# EAGLE design main (EAGLE 7.1.0)
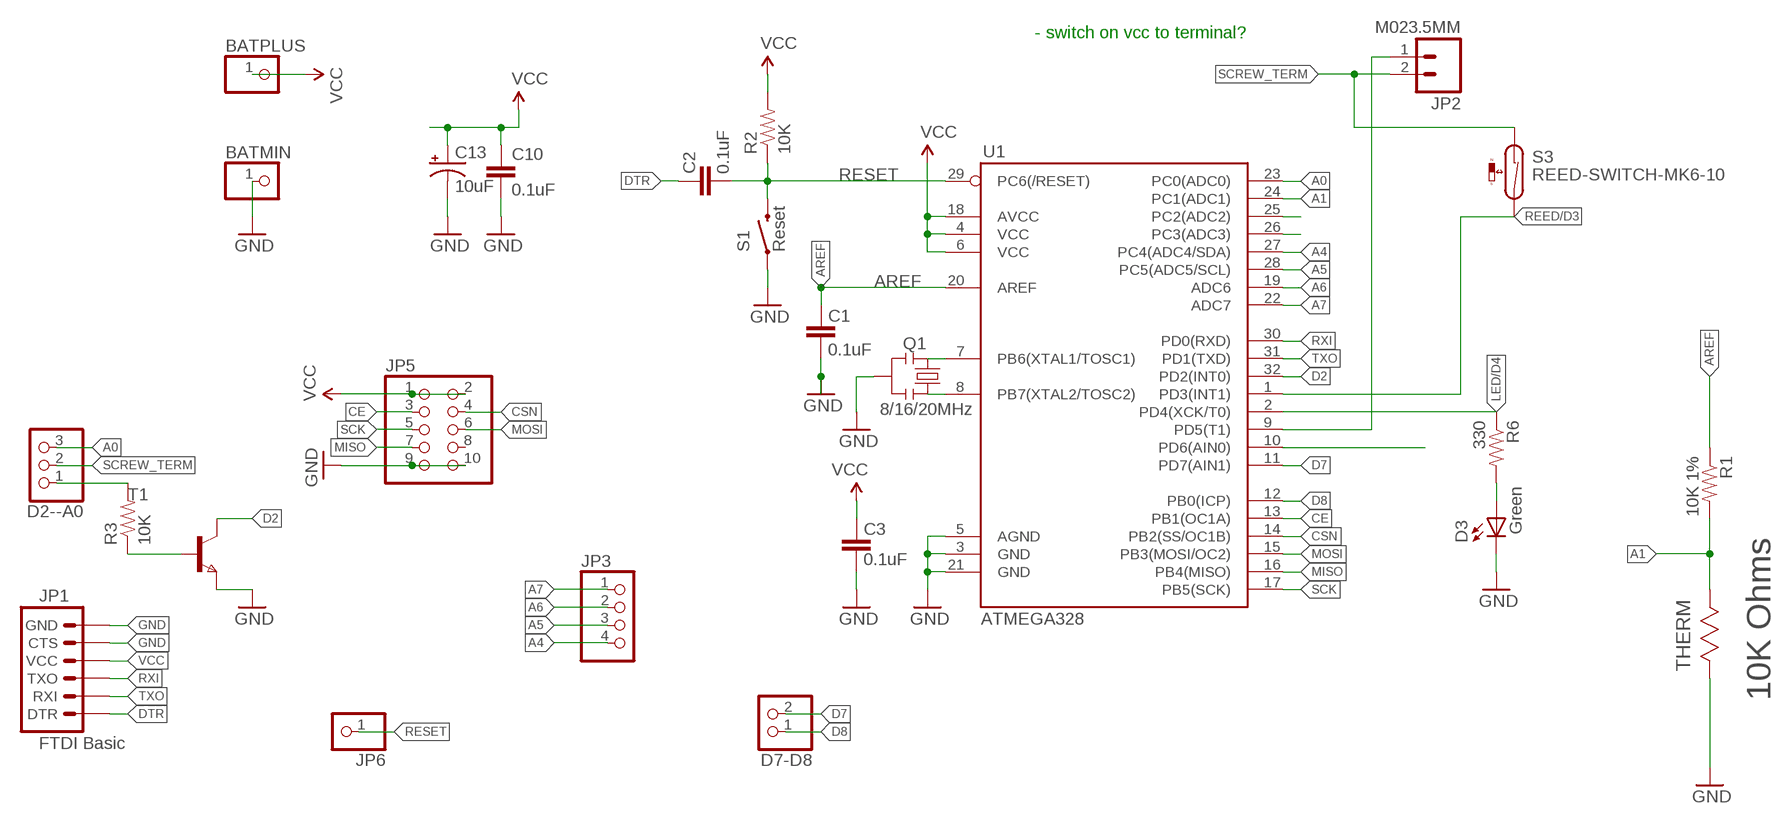
[diagram p0: schematic, sheet 1]

## Parts
BATMIN  PINHD-1X1  [1X01]
BATPLUS  PINHD-1X1  [1X01]
C1  0.1uF  CAP0603-CAP  [0603-CAP]
C2  0.1uF  CAP0603-CAP  [0603-CAP]
C3  0.1uF  CAP0603-CAP  [0603-CAP]
C10  0.1uF  CAP0603-CAP  [0603-CAP]
C13  10uF  CAP_POL1206  [EIA3216]
D2--A0  PINHD-1X3  [1X03]
D3  Green  LED  [0603-LED-ALT1]
D7-D8  PINHD-1X2  [1X02]
JP1  FTDI Basic  ARDUINO_SERIAL_PROGRAMPTH  [1X06]
JP2  M023.5MM  [SCREWTERMINAL-3.5MM-2]
JP3  PINHD-1X4  [1X04]
JP5  PINHD-2X5  [2X05]
JP6  PINHD-1X1  [1X01]
Q1  8/16/20MHz  RESONATOR1:1  [RESONATOR-SMD-1:1]
R1  10K 1%  RESISTOR0603-RES  [0603-RES]
R2  10K  RESISTOR0603-RES  [0603-RES]
R3  10K  RESISTOR0603-RES  [0603-RES]
R6  330  RESISTOR0603-RES  [0603-RES]
S1  Reset  SWITCH-MOMENTARY-2SMD-ALT01  [TACTILE-SWITCH-SMD-ALT01]
S3  REED-SWITCH-MK6-10  [MK6-10]
T1  NPNSOT323  [SOT323]
THERM  10K Ohms  NTCS0603E3103HMT  [RESC1608X95N]
U1  ATMEGA328  ATMEGA168  [TQFP32-08]

## Nets
A0: D2--A0.3 U1.23(PC0(ADC0))
A1: R1.2 THERM.1 U1.24(PC1(ADC1))
A2: U1.25(PC2(ADC2))
A3: U1.26(PC3(ADC3))
A4: JP3.4 U1.27(PC4(ADC4/SDA))
A5: JP3.3 U1.28(PC5(ADC5/SCL))
A6: JP3.2 U1.19(ADC6)
A7: JP3.1 U1.22(ADC7)
AREF: C1.2 R1.1 U1.20(AREF)
CE: JP5.3 U1.13(PB1(OC1A))
CSN: JP5.4 U1.14(PB2(SS/OC1B))
D2: T1.1(C) U1.32(PD2(INT0))
D5: JP2.1 U1.9(PD5(T1))
D7: D7-D8.2 U1.11(PD7(AIN1))
D8: D7-D8.1 U1.12(PB0(ICP))
DTR: C2.2 JP1.1(DTR)
GND [vcc]: BATMIN.1 C1.1 C3.1 C10.2 C13.C(-) D3.C JP1.5(CTS) JP1.6(GND) JP5.9 JP5.10 Q1.2 S1.1 S1.2 T1.3(E) THERM.2 U1.3(GND) U1.5(AGND) U1.21(GND)
LED/D4: R6.1 U1.2(PD4(XCK/T0))
MISO: JP5.7 U1.16(PB4(MISO))
MOSI: JP5.6 U1.15(PB3(MOSI/OC2))
N$1: Q1.3 U1.8(PB7(XTAL2/TOSC2))
N$2: Q1.1 U1.7(PB6(XTAL1/TOSC1))
N$3: D2--A0.1 R3.2
N$4: U1.10(PD6(AIN0))
N$6: R3.1 T1.2(B)
N$7: D3.A R6.2
REED/D3: S3.2 U1.1(PD3(INT1))
RESET: C2.1 JP6.1 R2.1 S1.3 S1.4 U1.29(PC6(/RESET))
RXI: JP1.3(TXO) U1.30(PD0(RXD))
SCK: JP5.5 U1.17(PB5(SCK))
SCREW_TERM: D2--A0.2 JP2.2 S3.1
TXO: JP1.2(RXI) U1.31(PD1(TXD))
VCC: BATPLUS.1 C3.2 C10.1 C13.A(+) JP1.4(VCC) JP5.1 JP5.2 R2.2 U1.4(VCC) U1.6(VCC) U1.18(AVCC)
Unconnected: JP5.8

## Notes on the sheet
- - switch on vcc to terminal?

## Library data of the parts
BATMIN BATPLUS JP6 = pinhead:PINHD-1X1: PIN HEADER
C1-C3 C10 = SparkFun:CAP: Capacitor Standard 0603 ceramic capacitor, and 0.1" leaded capacitor.
C13 = SparkFun:CAP_POL: Capacitor Polarized These are standard SMD and PTH capacitors. Normally 10uF, 47uF, and 100uF in electrolytic and tantalum varieties. Always verify the external diameter of the through hole cap, it varies with capacity, voltage, and manufacturer. The EIA devices should be standard.
D2--A0 = pinhead:PINHD-1X3: PIN HEADER
D3 = Testing:LED: LEDs Standard schematic elements and footprints for 5mm, 3mm, 1206, and 0603 sized LEDs. 5mm - Spark Fun Electronics SKU : COM-00529 (and others)
D7-D8 = pinhead:PINHD-1X2: PIN HEADER
JP1 = SparkFun:ARDUINO_SERIAL_PROGRAM
JP2 = SparkFun-Connectors:M02: Standard 2-pin 0.1" header. Use with - straight break away headers ( PRT-00116) - right angle break away headers (PRT-00553) - swiss pins (PRT-00743) - machine pins (PRT-00117) - female headers (PRT-00115) Molex polarized connector foot print use with: PRT-08233 with associated crimp pins and housings. 2.54_SCREWTERM for use with PRT-10571. 3.5mm Screw Terminal footprints for PRT-08084 5mm Screw Terminal footprints for use with PRT-08432
JP3 = pinhead:PINHD-1X4: PIN HEADER
JP5 = pinhead:PINHD-2X5: PIN HEADER
Q1 = Testing:RESONATOR: Resonator Small SMD resonator. This is the itty bitty 10/20MHz resonators with built in caps. CSTCE10M0G55 and CSTCE20M0V53. Footprint for SMD has been used in SFE production for years, and does work okay. 1:1 is an attempt to get larger fillets on the sides so it will be easier to inspect these solders in our AOI machine. The pads have been minimized to match the actual metal under the resonator. To see this relation, it includes an image import of the bottom side of the component. Imported to scale on layer 200.
R1-R3 R6 = SparkFun:RESISTOR: Resistor Basic schematic elements and footprints for 0603, 1206, and PTH resistors.
S1 = Testing:SWITCH-MOMENTARY-2: Various NO switches- pushbuttons, reed, etc
S3 = switch-reed:REED-SWITCH-: Reed Sensor; OC_FARNELL: unknown
T1 = zetex:NPNSOT323: NPN TRANSISTOR; MPN: DSS4160U-7; OC_FARNELL: 1710696; OC_NEWARK: 25R4558
THERM = Vishay_By_element14_Batch_1:NTCS0603E3103HMT: RESISTOR, 0603; MPN: NTCS0603E3103HMT; OC_FARNELL: 1874161; OC_NEWARK: 63H2050; SUPPLIER: Vishay; TOLERANCE: ± 3%; WATTAGE: 125 mW
U1 = SparkFun:ATMEGA168

## Net classes
1 vcc: width 0.254 mm

## Board
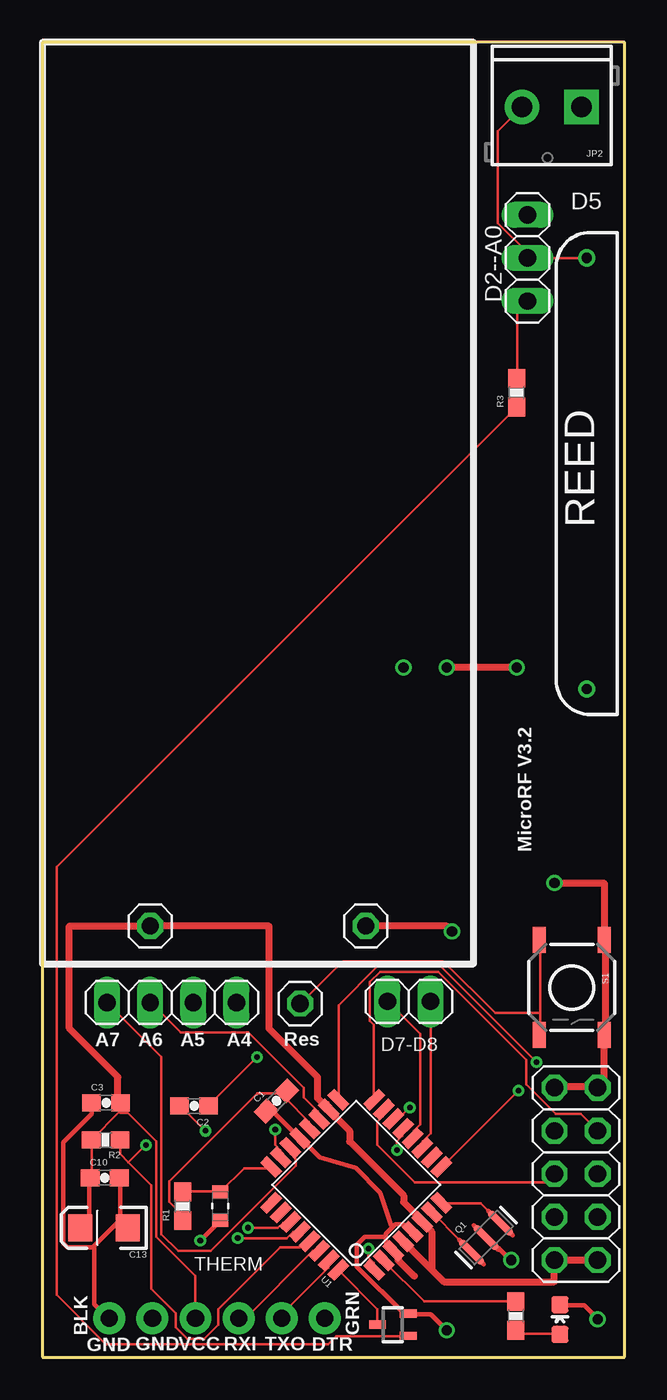
[diagram p1: board, top side]
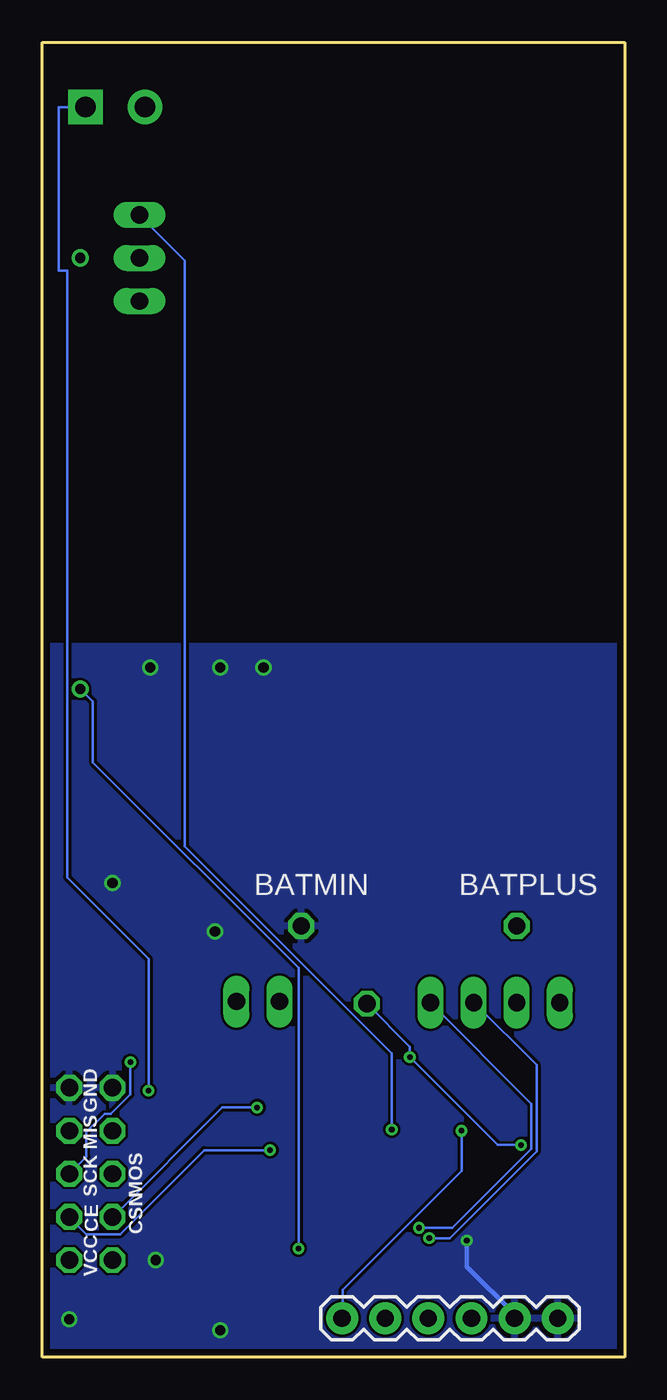
[diagram p2: board, bottom side, seen from below]

Size 34.29 x 77.47 mm. Coordinates in mm from the lower left corner, seen from the top.
Outline: 0,77.47 0,0 34.29,0 34.29,77.47 0,77.47
Copper layers (1*16): Top 0.0356mm / dielectric 1.5011mm / Bottom 0.0356mm
Design rules "OSHPark": minimum track width 6mil, minimum drill 13mil, track to track 6mil, track to pad 6mil, pad to pad 6mil, via to via 6mil, smd to smd 6mil, copper to edge 15mil, drill to drill 6mil, minimum pad ring 7mil, minimum via ring 7mil, stop-mask expansion 3mil, vias tented up to drill 0mil, thermal gap 10mil

### Footprints (pad centres in the part's own frame; a part is rotated, then mirrored left to right if it is on the bottom)
1X01 = drill 1.016 octagon: 1 0,0
0603-CAP = smd 1.1 x 1: 1 -0.85,0; 2 0.85,0
EIA3216 = smd 1.4 x 1.6: A 1.4,0; C -1.4,0
1X03 = drill 1.016 long: 1 -2.54,0; 2 0,0; 3 2.54,0
0603-LED-ALT1 = smd 1 x 1: A 0,-0.877; C 0,0.877
1X02 = drill 1.016 long: 1 -1.27,0; 2 1.27,0
1X06 = drill 1.016 pad 1.88: 1 0,0; 2 2.54,0; 3 5.08,0; 4 7.62,0; 5 10.16,0; 6 12.7,0
SCREWTERMINAL-3.5MM-2 = drill 1.2 pad 2.032 square: 1 0,0 | drill 1.2 pad 2.032: 2 3.5,0
1X04 = drill 1.016 long: 1 -3.81,0; 2 -1.27,0; 3 1.27,0; 4 3.81,0
2X05 = drill 1.016 octagon: 1 -5.08,-1.27; 2 -5.08,1.27; 3 -2.54,-1.27; 4 -2.54,1.27; 5 0,-1.27; 6 0,1.27; 7 2.54,-1.27; 8 2.54,1.27; 9 5.08,-1.27; 10 5.08,1.27
RESONATOR-SMD-1:1 = smd 0.45 x 1.905: 1 -1.2,0; 2 0,0; 3 1.2,0
0603-RES = smd 1.1 x 1: 1 -0.85,0; 2 0.85,0
TACTILE-SWITCH-SMD-ALT01 = smd 1.524 x 0.762: 1 -2.794,1.905; 2 2.794,1.905; 3 -2.794,-1.905; 4 2.794,-1.905
MK6-10 = drill 0.6 pad 1.016: 1 -12.7,0; 2 12.7,0
SOT323 = smd 0.5 x 1: 1 0,0.9; 2 -0.65,-0.9; 3 0.65,-0.9
RESC1608X95N = smd 0.762 x 0.94: 1 -0.838,0; 2 0.838,0
TQFP32-08 = smd 1.27 x 0.559: 1 -4.293,2.8; 2 -4.293,2; 3 -4.293,1.2; 4 -4.293,0.4; 5 -4.293,-0.4; 6 -4.293,-1.2; 7 -4.293,-2; 8 -4.293,-2.8; 17 4.293,-2.8; 18 4.293,-2; 19 4.293,-1.2; 20 4.293,-0.4; 21 4.293,0.4; 22 4.293,1.2; 23 4.293,2; 24 4.293,2.8 | smd 0.559 x 1.27: 9 -2.8,-4.293; 10 -2,-4.293; 11 -1.2,-4.293; 12 -0.4,-4.293; 13 0.4,-4.293; 14 1.2,-4.293; 15 2,-4.293; 16 2.8,-4.293; 25 2.8,4.293; 26 2,4.293; 27 1.2,4.293; 28 0.4,4.293; 29 -0.4,4.293; 30 -1.2,4.293; 31 -2,4.293; 32 -2.8,4.293

### Placement (x,y rotation side)
BATMIN  19.05,25.4 0 top
BATPLUS  6.35,25.4 0 top
C1  13.79,15.09 45 top
C2  8.93,14.8 180 top
C3  3.75,14.99 0 top
C10  3.67,10.57 0 top
C13  3.62,7.62 180 top
D2--A0  28.57,64.77 90 top
D3  30.48,2.21 0 top
D7-D8  21.59,20.95 0 top
JP1  16.64,2.29 0 bottom
JP2  31.75,73.66 180 top
JP3  7.62,20.89 0 top
JP5  31.43,10.79 90 top
JP6  15.18,20.83 0 top
Q1  26.13,7.05 45 top
R1  8.26,8.89 90 top
R2  3.72,12.8 180 top
R3  27.94,56.83 90 top
R6  27.88,2.43 270 top
S1  31.18,21.78 270 top
S3  32.07,52.07 270 top
T1  20.64,1.91 90 top
THERM  10.48,8.89 270 top
U1  18.49,10.15 135 top

### Tracks (layer width: path | path; a pad name or v marks a point on that pad's centre or on a via)
A0  (via drill 0.33)
  Top 0.152: v13.72,13.41 13.72,12.5 14.02,12.19 14.02,11.81 U1.23
  Bottom 0.152: v13.72,13.41 13.72,17.91 25.91,30.1 25.91,64.62 28.57,67.28 D2--A0.3
A1
  Top 0.152: R1.2 8.31,9.75 10.44,9.75 THERM.1 10.52,9.75 11.89,11.12 13.41,11.12 U1.24
A4  (via drill 0.33)
  Top 0.152: v12.12,7.62 13.87,7.62 14.17,7.92 14.55,7.92 U1.27
  Bottom 0.152: v12.12,7.62 10.13,7.62 5.49,12.27 5.49,14.94 JP3.4
A5  (via drill 0.33)
  Top 0.152: v11.51,7.01 14.4,7.01 14.78,7.39 U1.28
  Bottom 0.152: v11.51,7.01 10.29,7.01 5.18,12.12 5.18,17.22 8.84,20.88 JP3.3
A6
  Top 0.152: U1.19 16.23,14.1 16.23,14.48 15.39,15.32 15.39,15.85 12.12,19.13 8.15,19.13 6.4,20.88 JP3.2
A7
  Top 0.152: U1.22 14.63,12.27 14.63,11.96 14.94,11.66 14.94,11.28 9.91,6.25 8,6.25 7.01,7.24 7.01,17.68 JP3.1
AREF
  Top 0.152: U1.20 15.7,13.49 15.7,13.87 14.33,15.24 14.33,15.54 C1.2 14.25,15.54 12.65,15.54 7.47,10.36 7.47,9.14 8.23,8.38 8.23,8.08 R1.1
CE  (via drill 0.33)
  Top 0.152: v20.88,12.19 20.88,12.72 21.18,13.03 21.18,13.41 U1.13
  Bottom 0.152: v20.88,12.19 24.77,12.19 29.72,7.24 31.7,7.24 32.69,8.23 JP5.3
CSN  (via drill 0.33)
  Top 0.152: v21.64,14.71 21.03,14.1 20.73,14.1 U1.14
  Bottom 0.152: v21.64,14.71 23.7,14.71 30.1,8.31 JP5.4
D2
  Top 0.152: T1.1 19.74,2.82 17.45,5.11 U1.32
D5  (via drill 0.33)
  Top 0.152: v28.04,15.7 23.55,11.2 U1.9 | 31.77,73.61 JP2.1
  Bottom 0.152: v28.04,15.7 28.04,23.47 32.84,28.27 32.84,64.01 33.34,64.01 33.34,73.66 JP2.1
D7
  Top 0.152: D7-D8.2 22.86,13.18 22.4,12.72 22.4,12.34 U1.11
D8
  Top 0.152: U1.12 21.87,12.95 21.87,13.34 22.25,13.72 22.25,19.05 20.34,20.95 D7-D8.1
DTR  (via drill 0.33)
  Top 0.152: v9.6,13.34 8.15,14.78 C2.2
  Bottom 0.152: v9.6,13.34 9.6,10.97 16.61,3.96 16.61,2.29 JP1.1
GND  (via drill 0.33, 0.6)
  Top 0.254: C10.2 4.6,10.55 4.6,8.04 4.94,7.7 C13.C 4.5,8 2.97,6.48 | 20.21,7.09 20.21,7.25 20.61,7.66 | 20.21,7.09 20.21,6.76 20.7,6.28 U1.3 | 20.61,7.66 20.78,7.82 21.26,7.82 21.75,7.33 U1.5 | 20.61,7.66 20.53,7.74 19.9,9.69 18.45,11.14 16.33,11.78 15.2,12.91 U1.21 15.09,12.95 13.56,14.48 13.26,14.48 C1.1 | 2.97,6.48 1.45,6.48 1.22,6.71 1.22,12.65 2.9,14.33 2.9,14.94 C3.1 | D3.C 30.48,3.05 31.93,3.05 32.69,2.29 v32.7,2.22 | 32.69,15.93 JP5.9 32.77,16 | 2.97,6.48 3.05,6.4 3.05,3.12 3.89,2.29 JP1.6 | 33.07,18.97 S1.2 | 33.15,24.54 S1.1 | v23.81,1.59 23.77,1.6 22.86,2.52 21.57,2.52 T1.3 21.41,2.52 21.34,2.52 18.52,5.33 18.52,6.63 18.97,7.09 20.21,7.09 | Q1.2 26.98,6.33 27.58,5.71 v27.62,5.71 | v9.3,6.86 10.44,8 THERM.2
  Top 0.406: v30.16,27.94 33.08,27.94 S1.1 | v27.94,40.64 v23.81,40.64 | v24.13,25.08 23.81,25.4 BATMIN.1 | 33.15,24.54 33.15,19.05 S1.2 | 33.07,18.97 33.07,16.24 JP5.9 | 32.69,15.93 30.21,15.93 JP5.10
  Bottom 0.254: 4.04,2.29 JP1.6 | 6.43,2.34 JP1.5 6.48,2.52 9.3,5.33 v9.3,6.86
  other vias: 21.27,40.64
  pour Bottom: 0,41.91 0,0 34.29,0 34.29,41.91
LED/D4
  Top 0.152: R6.1 27.81,3.28 22.48,3.28 20.12,5.64 U1.2
MISO
  Top 0.152: U1.16 19.51,15.16 19.51,19.58 19.28,19.81 19.28,22.1 19.89,22.71 23.32,22.71 28.5,17.53 28.5,16.08 30.25,14.33 31.7,14.33 JP5.7
MOSI
  Top 0.152: U1.15 20.04,14.55 20.04,14.17 19.74,13.87 19.74,12.5 21.95,10.29 29.64,10.29 30.1,10.74 JP5.6
N$1
  Top 0.152: U1.8 23.55,9.07 25.83,9.07 26.21,8.69 26.26,8.62
N$2
  Top 0.152: U1.7 23.01,8.46 24.54,6.93 24.57,6.92
N$3
  Top 0.152: R3.2 27.96,57.68 27.96,61.57 28.57,62.18 D2--A0.1
N$5
  Top 0.406: 20.95,6.03 20.95,5.71 21.91,4.76
N$6
  Top 0.152: T1.2 21.49,1.22 17.3,1.22 16.84,0.76 3.73,0.76 0.84,3.66 0.84,28.88 27.89,55.93 R3.1
N$7
  Top 0.152: D3.A 30.48,1.37 28.04,1.37 27.89,1.52 R6.2
REED/D3  (via drill 0.33)
  Top 0.152: v19.2,6.4 19.2,5.87 19.51,5.56 19.51,5.18 U1.1
  Bottom 0.152: v19.2,6.4 19.2,22.94 31.32,35.05 31.32,38.63 32,39.32 S3.2
RESET  (via drill 0.33)
  Top 0.152: 5.07,11.47 6.4,10.13 6.4,4.04 7.85,2.59 7.85,1.75 8.53,1.07 9.53,1.07 10.36,1.91 10.36,2.82 14.02,6.48 15.39,6.48 15.7,6.78 U1.29 | 5.07,11.47 4.57,11.96 R2.1 | v12.65,17.68 9.83,14.86 C2.1 | v6.1,12.5 5.07,11.47 | 29.34,20.27 29.34,24.54 S1.3 | 29.34,20.27 29.34,19.05 S1.4 | 29.34,20.27 26.67,20.27 23.62,23.32 17.68,23.32 15.24,20.88 JP6.1
  Bottom 0.152: JP6.1 15.16,20.8 12.65,18.29 v12.65,17.68 7.47,12.5 v6.1,12.5
RXI
  Top 0.152: JP1.3 11.96,2.29 15.93,6.25 16.23,6.25 U1.30
SCK  (via drill 0.33)
  Top 0.152: v29.11,17.37 23.47,23.01 19.74,23.01 17.45,20.73 U1.17
  Bottom 0.152: v29.11,17.37 29.11,15.47 30.25,14.33 30.63,14.33 31.7,13.26 31.7,11.81 32.69,10.82 JP5.5
SCREW_TERM
  Top 0.152: JP2.2 28.19,73.61 26.82,72.24 26.82,66.83 28.57,65.08 D2--A0.2 S3.1
TXO
  Top 0.152: JP1.2 14.1,2.52 16.84,5.26 16.84,5.64 U1.31
VCC
  Top 0.152: 22.02,8.38 22.33,8.08 U1.6 | 16.92,14.55 U1.18 16.84,14.63 16.84,15.01 | 2.9,12.8 2.9,10.67 C10.1 | 2.9,12.8 4.53,14.44 | 4.53,14.44 4.57,14.48 4.57,14.94 C3.2 4.57,15.01 | 2.9,12.8 R2.2 | 6.1,25.38 6.33,25.38 BATPLUS.1 6.4,25.38 | JP1.4 8.99,2.29 8.99,4.8 6.71,7.09 6.71,12.72 5.03,14.4 4.57,14.4 4.53,14.44
  Top 0.254: 21.24,6.8 U1.4 | C10.1 2.77,10.55 2.77,8.15 2.31,7.7 C13.A
  Top 0.406: JP5.1 JP5.2 30.16,4.45 23.63,4.45 22.93,5.14 | U1.4 22.93,5.14 | 4.57,15.01 4.45,15.14 4.45,16.51 1.59,19.37 1.59,25.4 BATPLUS.1 13.34,25.4 13.34,19.37 16.19,16.51 16.19,15.27 U1.18 | U1.6 22.93,7.41 22.93,5.14 | 16.92,14.55 16.92,14.52 18.1,13.34 18.1,12.7 21.27,9.53 21.27,9.13 22.02,8.38

### Text on the board
tPlace: D5 | REED | MicroRF V3.2 | A7 | A6 | A5 | A4 | Res | BLK | GND | GRN | GND | VCC | RXI | TXO | DTR
bPlace: GND | MIS | MOS | SCK | CE | CSN | VCC
tValues: Valid combinations: | 168V / 3.3V Reg / 8MHz | 168 / 5V Reg / 16MHz | 168 / 5V Reg / 20MHz | Mark back accordingly